# EAGLE design CAPSTONE_PCB_TAKE1 (EAGLE 9.6.2)
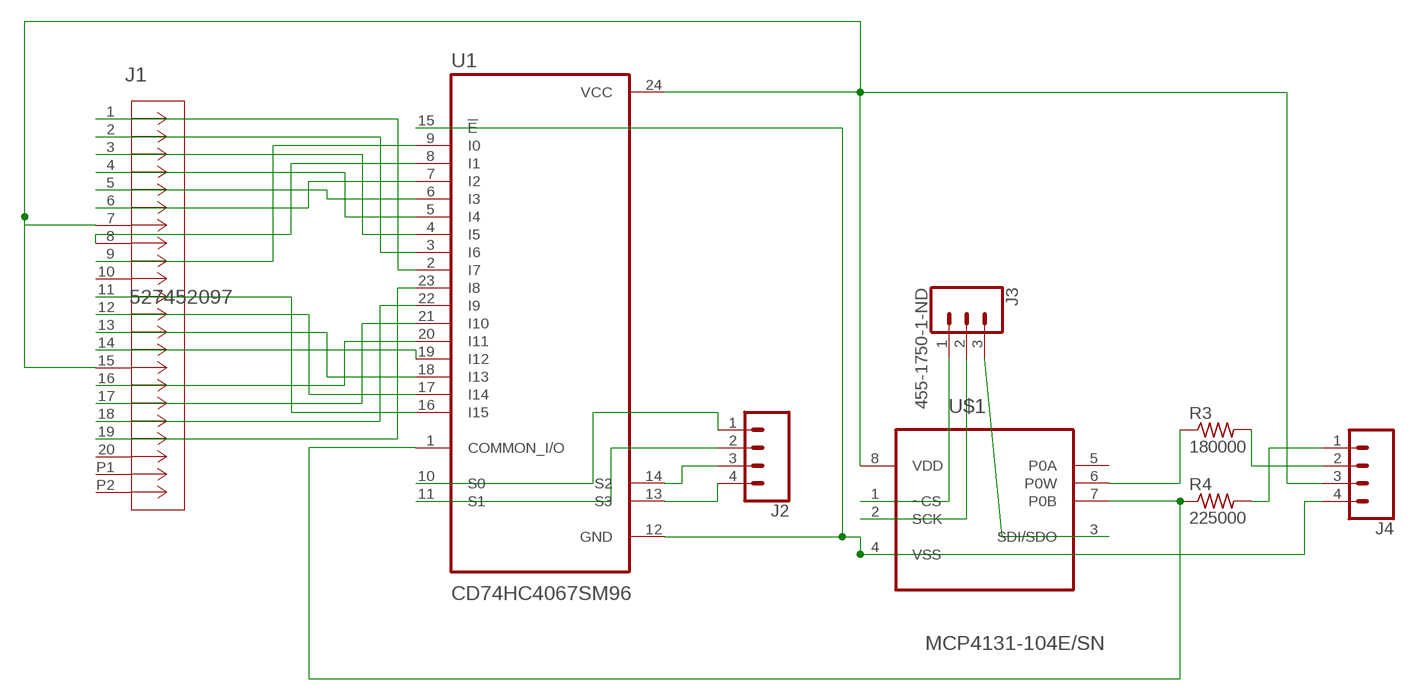
[diagram p0: schematic, sheet 1]

## Parts
J1  527452097  [CON_527452097_MOL]
J2  CONN_04LOCK  [1X04_LOCK]
J3  455-1750-1-ND  CONN_03  [1X03]
J4  CONN_04LOCK  [1X04_LOCK]
R3  180000  R-US_0204/2V  [0204V]
R4  225000  R-US_0204/2V  [0204V]
U1  CD74HC4067SM96  [SOP65P780X200-24N]
U$1  MCP4131-104E/SN  [SOIC127P600X175-8N]

## Nets
N$1: J1.1 U1.2(I7)
N$2: J1.2 U1.3(I6)
N$3: J1.3 U1.4(I5)
N$4: J1.4 U1.5(I4)
N$5: J1.5 U1.6(I3)
N$6: J1.6 U1.7(I2)
N$7: J1.8 U1.8(I1)
N$8: J1.9 U1.9(I0)
N$9: J1.19 U1.23(I8)
N$10: J1.18 U1.22(I9)
N$11: J1.17 U1.21(I10)
N$12: J1.16 U1.20(I11)
N$13: J1.14 U1.19(I12)
N$14: J1.13 U1.18(I13)
N$15: J1.12 U1.17(I14)
N$16: J1.11 U1.16(I15)
N$20: R4.1 U1.1(COMMON_I/O) U$1.7(P0B)
N$21: R3.1 U$1.6(P0W)
N$23: J3.1 U$1.1(~CS)
N$24: J3.2 U$1.2(SCK)
N$25: J3.3 U$1.3(SDI/SDO)
N$26: J4.2 R3.2
N$27: J4.1 R4.2
N$28: J2.4 U1.13(S3)
N$29: J2.3 U1.14(S2)
N$30: J2.2 U1.11(S1)
N$31: J2.1 U1.10(S0)
N$32: J4.4 U1.12(GND) U1.15(!E) U$1.4(VSS)
VIN(3.3V): J1.7 J1.15 J4.3 U1.24(VCC) U$1.8(VDD)
Unconnected: J1.10 J1.20 J1.P1 J1.P2 U$1.5(P0A)

## Library data of the parts
J1 = 527452097:527452097: Check availability <https://pricing.snapeda.com/parts/527452097/Molex/view-part?ref=eda>; AVAILABILITY: In Stock; CHECK_PRICES: https://www.snapeda.com/parts/527452097/Molex/view-part/?ref=eda; DESCRIPTION: 20 Position - Connector Contacts, Top 0.020 (0.50mm) Surface Mount, Right Angle; MF: Molex; MP: 527452097; PACKAGE: None; PRICE: None; SNAPEDA_LINK: https://www.snapeda.com/parts/527452097/Molex/view-part/?ref=snap
J2 J4 = SparkFun-Connectors:CONN_04: Multi connection point. Often used as Generic Header-pin footprint for 0.1 inch spaced/style header connections On any of the 0.1 inch spaced packages, you can populate with these: Break Away Headers - Straight <https://www.sparkfun.com/products/116> (PRT-00116) Break Away Male Headers - Right Angle <https://www.sparkfun.com/products/553> (PRT-00553) Female Headers <https://www.sparkfun.com/products/115> (PRT-00115) Break Away Headers - Machine Pin <https://www.sparkfun.com/products/117> (PRT-00117) Break Away Female Headers - Swiss Machine Pin <https://www.sparkfun.com/products/743> (PRT-00743) For SCREWTERMINALS and SPRING TERMINALS visit here: Screw Terimnals on SparkFun.com <https://www.sparkfun.com/search/results?term=Screw+Terminals> (5mm/3.5mm/2.54mm spacing) This device is also useful as a general connection point to wire up your design to another part of your project. Our various solder wires solder well into these plated through hole pads. Hook-Up Wire - Assortment (Stranded, 22 AWG) <https://www.sparkfun.com/products/11375> (PRT-11375) Hook-Up Wire - Assortment (Solid Core, 22 AWG) <https://www.sparkfun.com/products/11367> (PRT-11367) View the entire wire category on our website here <https://www.sparkfun.com/categories/141> Special notes: Molex polarized connector foot print use with SKU : PRT-08231 with associated crimp pins and housings. 1MM SMD Version SKU: PRT-10208; PROD_ID: CONN-09696
J3 = SparkFun-Connectors:CONN_03: Multi connection point. Often used as Generic Header-pin footprint for 0.1 inch spaced/style header connections On any of the 0.1 inch spaced packages, you can populate with these: Break Away Headers - Straight <https://www.sparkfun.com/products/116> (PRT-00116) Break Away Male Headers - Right Angle <https://www.sparkfun.com/products/553> (PRT-00553) Female Headers <https://www.sparkfun.com/products/115> (PRT-00115) Break Away Headers - Machine Pin <https://www.sparkfun.com/products/117> (PRT-00117) Break Away Female Headers - Swiss Machine Pin <https://www.sparkfun.com/products/743> (PRT-00743) Stackable Header - 3 Pin (Female, 0.1") <https://www.sparkfun.com/products/13875> (PRT-13875) For SCREWTERMINALS and SPRING TERMINALS visit here: Screw Terimnals on SparkFun.com <https://www.sparkfun.com/search/results?term=Screw+Terminals> (5mm/3.5mm/2.54mm spacing) This device is also useful as a general connection point to wire up your design to another part of your project. Our various solder wires solder well into these plated through hole pads. Hook-Up Wire - Assortment (Stranded, 22 AWG) <https://www.sparkfun.com/products/11375> (PRT-11375) Hook-Up Wire - Assortment (Solid Core, 22 AWG) <https://www.sparkfun.com/products/11367> (PRT-11367) View the entire wire category on our website here <https://www.sparkfun.com/categories/141> Special notes: Molex polarized connector foot print use with SKU : PRT-08232 with associated crimp pins and housings.; PROD_ID: XXX-00000
R3 R4 = rcl:R-US_: RESISTOR, American symbol; SPICEPREFIX: R
U1 = CD74HC4067SM96:CD74HC4067SM96; CHECK_PRICES: https://www.snapeda.com/parts/CD74HC4067SM96/Texas+Instruments/view-part/?ref=eda; DESCRIPTION: 5-V, 16:1, 1-channel analog multiplexer; DIGIKEY_PART_NUMBER: 296-9226-1-ND; MF: Texas Instruments; MP: CD74HC4067SM96; PACKAGE: SSOP-24 Texas Instruments; SNAPEDA_LINK: https://www.snapeda.com/parts/CD74HC4067SM96/Texas+Instruments/view-part/?ref=snap
U$1 = MCP4131-104E_SN:MCP4131-104E/SN; CHECK_PRICES: https://www.snapeda.com/parts/MCP4131-104E/SN/Microchip+Technology/view-part/?ref=eda; DESCRIPTION: MCP4131-104E/SN,Digi Potentiometer 100kOhm 129-Pos Linear Serial-SPI 8-Pin SOIC | Microchip Technology Inc. MCP4131-104E/SN; DIGIKEY_PART_NUMBER: MCP4131-104E/SN-ND; MF: Microchip; MP: MCP4131-104E/SN; PACKAGE: SO-8 Microchip; SNAPEDA_LINK: https://www.snapeda.com/parts/MCP4131-104E/SN/Microchip+Technology/view-part/?ref=snap

## Net classes
0 default: clearance 0.205 mm

## Board
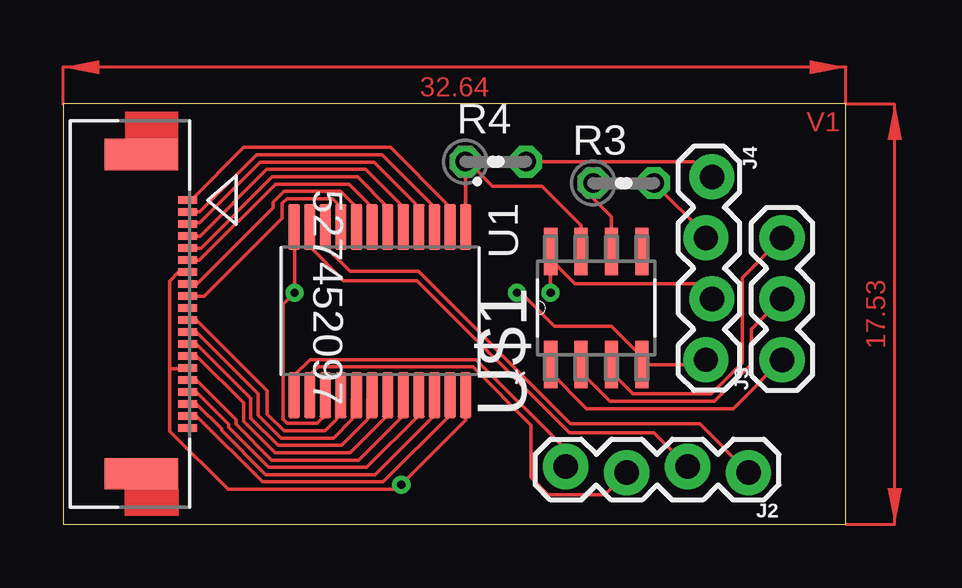
[diagram p1: board, top side]
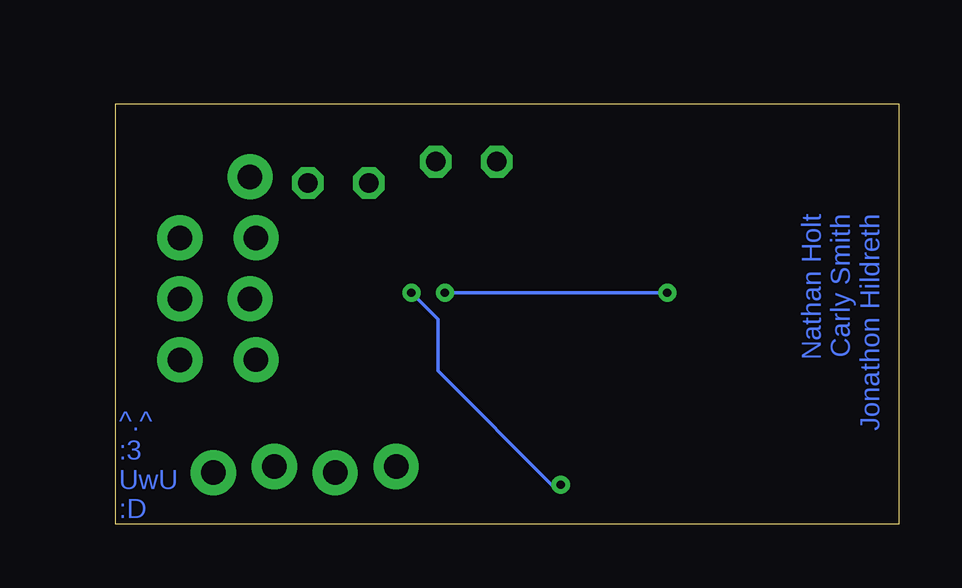
[diagram p2: board, bottom side, seen from below]

Size 32.64 x 17.53 mm. Coordinates in mm from the lower left corner, seen from the top.
Outline: 0,0 32.64,0 32.64,17.53 0,17.53 0,0
Copper layers (1*16): Top 0.035mm / dielectric 1.5mm / Bottom 0.035mm
Design rules "default *": minimum track width 6mil, minimum drill 0.35mm, track to track 5mil, track to pad 5mil, pad to pad 5mil, via to via 5mil, smd to smd 5mil, copper to edge 40mil, drill to drill 6mil, minimum pad ring 10mil, minimum via ring 8mil, stop-mask expansion 4mil, vias tented up to drill 0mil, thermal gap 10mil

### Footprints (pad centres in the part's own frame; a part is rotated, then mirrored left to right if it is on the bottom)
CON_527452097_MOL = smd 0.3 x 0.8: 1 -4.75,2.4; 2 -4.25,2.4; 3 -3.75,2.4; 4 -3.25,2.4; 5 -2.75,2.4; 6 -2.25,2.4; 7 -1.75,2.4; 8 -1.25,2.4; 9 -0.75,2.4; 10 -0.25,2.4; 11 0.25,2.4; 12 0.75,2.4; 13 1.25,2.4; 14 1.75,2.4; 15 2.25,2.4; 16 2.75,2.4; 17 3.25,2.4; 18 3.75,2.4; 19 4.25,2.4; 20 4.75,2.4 | smd 1.3 x 3.05: P1 -6.65,0.475; P2 6.65,0.475
1X04_LOCK = drill 1.016 pad 1.88: 1 0,0.127; 2 2.54,-0.127; 3 5.08,0.127; 4 7.62,-0.127
1X03 = drill 1.016 pad 1.88: 1 0,0; 2 2.54,0; 3 5.08,0
0204V = drill 0.813 octagon: 1 -1.27,0; 2 1.27,0
SOP65P780X200-24N = smd 1.9 x 0.48: 1 -3.505,3.575; 2 -3.505,2.925; 3 -3.505,2.275; 4 -3.505,1.625; 5 -3.505,0.975; 6 -3.505,0.325; 7 -3.505,-0.325; 8 -3.505,-0.975; 9 -3.505,-1.625; 10 -3.505,-2.275; 11 -3.505,-2.925; 12 -3.505,-3.575; 13 3.505,-3.575; 14 3.505,-2.925; 15 3.505,-2.275; 16 3.505,-1.625; 17 3.505,-0.975; 18 3.505,-0.325; 19 3.505,0.325; 20 3.505,0.975; 21 3.505,1.625; 22 3.505,2.275; 23 3.505,2.925; 24 3.505,3.575
SOIC127P600X175-8N = smd 1.981 x 0.559: 1 -2.362,1.905; 2 -2.362,0.635; 3 -2.362,-0.635; 4 -2.362,-1.905; 5 2.362,-1.905; 6 2.362,-0.635; 7 2.362,0.635; 8 2.362,1.905

### Placement (x,y rotation side)
J1  2.79,8.76 270 top
J2  28.57,2.29 180 top
J3  29.97,6.86 90 top
J4  26.92,14.48 270 top
R3  23.37,14.22 0 top
R4  18.03,15.11 0 top
U1  13.21,8.89 270 top
U$1  22.23,9.02 90 top

### Tracks (layer width: path | path; a pad name or v marks a point on that pad's centre or on a via)
N$1
  Top 0.152: U1.2 16.05,12.48 16.05,13.3 13.65,15.71 7.53,15.71 5.33,13.51 J1.1
N$2
  Top 0.152: U1.3 15.44,12.43 15.44,13.26 13.3,15.4 8.06,15.4 5.69,13.03 5.21,13.03 J1.2
N$3
  Top 0.152: J1.3 5.25,12.57 5.69,12.57 8.21,15.1 12.96,15.1 14.68,13.37 14.68,12.55 U1.4
N$4
  Top 0.152: U1.5 14.07,12.51 14.07,13.34 12.61,14.79 8.49,14.79 5.71,12.01 J1.4
N$5
  Top 0.152: J1.5 5.75,11.51 8.72,14.49 12.27,14.49 13.53,13.22 U1.6
N$6
  Top 0.152: J1.6 5.68,11.01 8.85,14.18 11.92,14.18 12.88,13.22 U1.7
N$7
  Top 0.152: J1.8 5.57,10.01 8.75,13.2 8.75,13.42 9.21,13.88 11.58,13.88 12.23,13.22 U1.8
N$8
  Top 0.152: U1.9 11.58,13.22 11.23,13.57 9.33,13.57 9.13,13.37 9.13,12.76 5.88,9.51 J1.9
N$9
  Top 0.152: U1.23 16.13,4.56 13.34,1.77 8.31,1.77 5.57,4.51 J1.19
N$10
  Top 0.152: U1.22 15.48,4.56 13,2.07 8.45,2.07 6.6,3.92 6.6,3.98 5.57,5.01 J1.18
N$11
  Top 0.152: U1.21 14.83,4.56 12.65,2.38 8.58,2.38 6.91,4.04 6.91,4.17 5.57,5.51 J1.17
N$12
  Top 0.152: U1.20 14.18,4.56 12.31,2.68 8.7,2.68 7.21,4.17 7.21,4.37 5.57,6.01 J1.16
N$13
  Top 0.152: U1.19 13.53,4.56 11.96,2.99 8.83,2.99 7.52,4.3 7.52,5.06 5.57,7.01 J1.14
N$14
  Top 0.152: U1.18 12.7,5.2 12.7,4.38 11.62,3.29 8.96,3.29 7.82,4.42 7.82,5.26 5.57,7.51 J1.13
N$15
  Top 0.152: U1.17 12.05,5.2 12.05,4.38 11.27,3.6 9.08,3.6 8.13,4.55 8.13,5.45 5.57,8.01 J1.12
N$16
  Top 0.152: J1.11 5.57,8.51 8.51,5.57 8.51,4.6 9.21,3.9 10.93,3.9 11.4,4.38 11.4,5.2 U1.16
N$20
  Top 0.152: U1.1 16.78,15.09 R4.1 16.89,15.11 17.91,14.1 19.96,14.1 21.59,12.46 U$1.7
N$21
  Top 0.152: R3.1 22.1,13.59 22.86,12.83 U$1.6
N$23
  Top 0.152: J3.1 27.94,4.83 21.83,4.83 20.32,6.33 U$1.1
N$24
  Top 0.152: J3.2 28.7,8.13 28.7,6.68 27.15,5.13 22.79,5.13 21.59,6.33 U$1.2
N$25
  Top 0.152: J3.3 28.32,10.29 28.32,6.73 27.03,5.44 23.76,5.44 22.86,6.33 U$1.3
N$26
  Top 0.152: R3.2 26.8,12.06 J4.2
N$27
  Top 0.152: J4.1 26.92,14.48 26.29,15.11 R4.2
N$28
  Top 0.152: U1.13 9.63,6.21 10.29,6.87 17.21,6.87 20.96,3.12 J2.4
N$29
  Top 0.152: U1.14 10.28,6.21 10.63,6.56 17.08,6.56 19.51,4.14 19.51,1.95 20.22,1.24 22.58,1.24 J2.3
N$30
  Top 0.152: U1.11 10.29,11.56 11.69,10.16 14.76,10.16 21.11,3.81 24.64,3.81 J2.2
N$31
  Top 0.152: U1.10 10.93,11.57 11.96,10.54 14.81,10.54 21.16,4.19 26.54,4.19 J2.1
N$32  (via drill 0.35)
  Top 0.152: U1.12 9.65,12.38 v9.65,9.65 9.16,9.16 9.16,4.38 9.33,4.21 10.58,4.21 10.93,4.56 U1.15 | J4.4 26.59,6.65 U$1.4 24.13,6.98 22.85,8.26 20.48,8.26 19.08,9.65 v18.92,9.65
  Bottom 0.152: v18.92,9.65 v9.65,9.65
VIN(3.3V)  (via drill 0.35)
  Top 0.152: J1.15 5.16,6.48 4.44,6.48 | v20.32,9.65 U$1.8 20.32,11.06 21.34,10.03 26.42,10.03 J4.3 | 4.44,6.48 4.44,3.89 6.87,1.46 13.91,1.46 v14.1,1.65 16.78,4.34 U1.24 | 4.44,6.48 4.44,10.14 4.83,10.52 J1.7
  Bottom 0.152: v14.1,1.65 14.22,1.52 14.35,1.52 19.22,6.39 19.22,8.55 v20.32,9.65
(copper drawn outside any net)
  shapes: Top area x2

### Text on the board
Top: V1
Bottom: Nathan Holt / Carly Smith / Jonathon Hildreth | ^.^ / :3 / UwU / :D